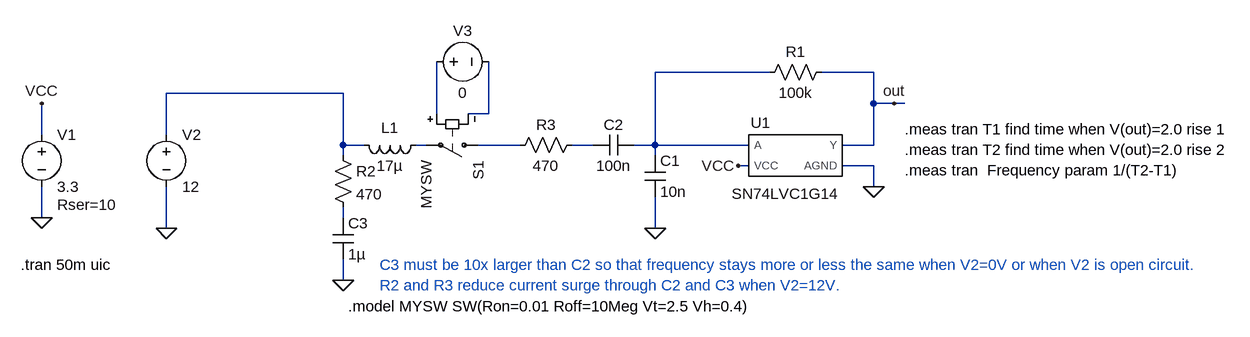
[diagram p0: schematic CapacitiveCoupling.asc]
CapacitiveCoupling.asc, the LTspice schematic file:
Version 4
SHEET 1 1580 680
WIRE 816 -80 640 -80
WIRE 976 -80 896 -80
WIRE 160 -48 -112 -48
WIRE 976 -32 976 -80
WIRE 1008 -32 976 -32
WIRE 1024 -32 1008 -32
WIRE 304 -16 304 -96
WIRE 384 -16 384 -96
WIRE 384 -16 352 -16
WIRE -304 16 -304 -32
WIRE -112 16 -112 -48
WIRE 160 32 160 -48
WIRE 192 32 160 32
WIRE 288 32 272 32
WIRE 432 32 368 32
WIRE 544 32 512 32
WIRE 640 32 640 -80
WIRE 640 32 608 32
WIRE 784 32 640 32
WIRE 976 32 976 -32
WIRE 976 32 928 32
WIRE 160 48 160 32
WIRE 640 48 640 32
WIRE 784 64 768 64
WIRE 976 64 928 64
WIRE 976 96 976 64
WIRE -304 144 -304 96
WIRE 160 144 160 128
WIRE -112 160 -112 96
WIRE 640 160 640 112
WIRE 160 240 160 208
FLAG -304 144 0
FLAG -304 -32 VCC
FLAG 768 64 VCC
FLAG 640 160 0
FLAG 976 96 0
FLAG -112 160 0
FLAG 160 240 0
FLAG 1008 -32 out
SYMBOL voltage -304 0 R0
WINDOW 123 0 0 Left 0
WINDOW 39 24 124 Left 2
SYMATTR SpiceLine Rser=10
SYMATTR InstName V1
SYMATTR Value 3.3
SYMBOL res 912 -96 R90
WINDOW 0 0 56 VBottom 2
WINDOW 3 32 56 VTop 2
SYMATTR InstName R1
SYMATTR Value 100k
SYMBOL cap 624 48 R0
SYMATTR InstName C1
SYMATTR Value 10n
SYMBOL AutoGenerated\\SN74LVC1G14 832 48 R0
WINDOW 0 -30 -35 Bottom 2
SYMATTR InstName U1
SYMBOL voltage -112 0 R0
SYMATTR InstName V2
SYMATTR Value 12
SYMBOL cap 608 16 R90
WINDOW 0 0 32 VBottom 2
WINDOW 3 32 32 VTop 2
SYMATTR InstName C2
SYMATTR Value 100n
SYMBOL cap 144 144 R0
SYMATTR InstName C3
SYMATTR Value 1µ
SYMBOL sw 384 32 R90
SYMATTR InstName S1
SYMATTR Value MYSW
SYMBOL voltage 288 -96 R270
WINDOW 0 32 56 VTop 2
WINDOW 3 -32 56 VBottom 2
SYMATTR InstName V3
SYMATTR Value 0
SYMBOL res 144 32 R0
SYMATTR InstName R2
SYMATTR Value 470
SYMBOL res 528 16 R90
WINDOW 0 0 56 VBottom 2
WINDOW 3 32 56 VTop 2
SYMATTR InstName R3
SYMATTR Value 470
SYMBOL ind 288 16 R90
WINDOW 0 5 56 VBottom 2
WINDOW 3 32 56 VTop 2
SYMATTR InstName L1
SYMATTR Value 17µ
TEXT -336 216 Left 2 !.tran 50m uic
TEXT 168 280 Left 2 !.model MYSW SW(Ron=0.01 Roff=10Meg Vt=2.5 Vh=0.4)
TEXT 216 216 Left 2 ;C3 must be 10x larger than C2 so that frequency stays more or less the same when V2=0V or when V2 is open circuit.
TEXT 216 248 Left 2 ;R2 and R3 reduce current surge through C2 and C3 when V2=12V.
TEXT 1024 8 Left 2 !.meas tran T1 find time when V(out)=2.0 rise 1\n.meas tran T2 find time when V(out)=2.0 rise 2\n.meas tran  Frequency param 1/(T2-T1)

The netlist it stands for:
* CapacitiveCoupling.asc
V1 VCC 0 3.3 Rser=10
R1 out N001 100k
C1 N001 0 10n
XU1 out N001 VCC 0 SN74LVC1G14  ; pins Y A VCC AGND
V2 N002 0 12
C2 N001 N007 100n
C3 N008 0 1µ
S1 N006 N005 N003 N004 MYSW
V3 N003 N004 0
R2 N002 N008 470
R3 N007 N006 470
L1 N005 N002 17µ
.tran 50m uic
.model MYSW SW(Ron=0.01 Roff=10Meg Vt=2.5 Vh=0.4)
* C3 must be 10x larger than C2 so that frequency stays more or less the same when V2=0V or when V2 is open circuit.
* R2 and R3 reduce current surge through C2 and C3 when V2=12V.
.meas tran T1 find time when V(out)=2.0 rise 1
.meas tran T2 find time when V(out)=2.0 rise 2
.meas tran  Frequency param 1/(T2-T1)
.lib SN74LVC1G14.cir
.backanno
.end